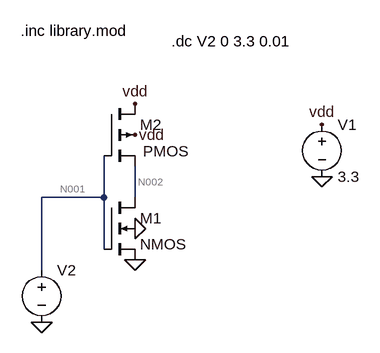
[diagram p0: schematic Draft3.asc]
Draft3.asc, the LTspice schematic file:
Version 4
SHEET 1 880 680
WIRE 144 304 144 240
WIRE 144 304 48 304
WIRE 192 304 192 256
WIRE 144 384 144 304
WIRE 48 416 48 304
FLAG 192 352 0
FLAG 192 400 0
FLAG 48 496 0
FLAG 480 272 0
FLAG 480 192 vdd
FLAG 192 160 vdd
FLAG 192 208 vdd
SYMBOL voltage 480 176 R0
WINDOW 123 0 0 Left 0
WINDOW 39 0 0 Left 0
SYMATTR InstName V1
SYMATTR Value 3.3
SYMBOL voltage 48 400 R0
WINDOW 123 0 0 Left 0
WINDOW 39 0 0 Left 0
SYMATTR InstName V2
SYMATTR Value ""
SYMBOL nmos4 144 304 R0
SYMATTR InstName M1
SYMATTR Value2 l=0.5u w=1u
SYMBOL pmos4 144 160 R0
WINDOW 3 60 73 Left 2
SYMATTR InstName M2
SYMATTR Value2 l=0.5u w=3.4u
TEXT 16 48 Left 2 !.inc library.mod
TEXT 248 64 Left 2 !.dc V2 0 3.3 0.01

The netlist it stands for:
* Draft3.asc
V1 vdd 0 3.3
V2 N001 0
M1 N002 N001 0 0 NMOS l=0.5u w=1u
M2 vdd N001 N002 vdd PMOS l=0.5u w=3.4u
.model NMOS NMOS
.model PMOS PMOS
.lib standard.mos
.inc library.mod
.dc V2 0 3.3 0.01
.backanno
.end

* Results of the author's LTspice run, read from the files saved beside the schematic
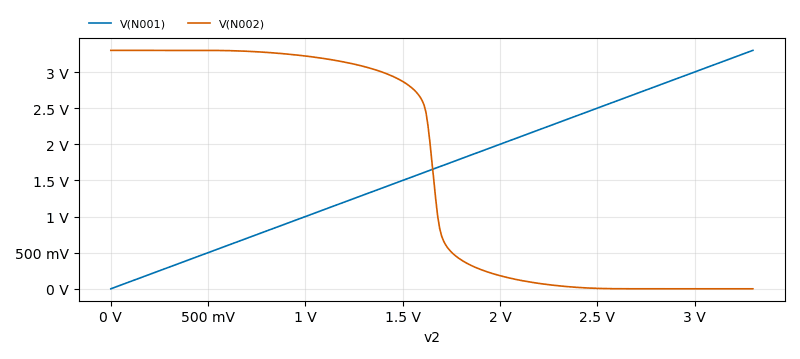
[diagram p1: DC transfer characteristic of Draft3.asc, plotted from the saved traces]
* DC transfer characteristic, 1 run:
*   V(N001): 0 V at v2=0 V, 3.3 V at v2=3.3 V, min 0 V, max 3.3 V
*   V(N002): 3.3 V at v2=0 V, 7.233 nV at v2=3.3 V, min 7.233 nV, max 3.3 V